# Altium schematic sheet XIAO_S3.SchDoc
size A4; SheetNumber: 2; SheetTotal: 7
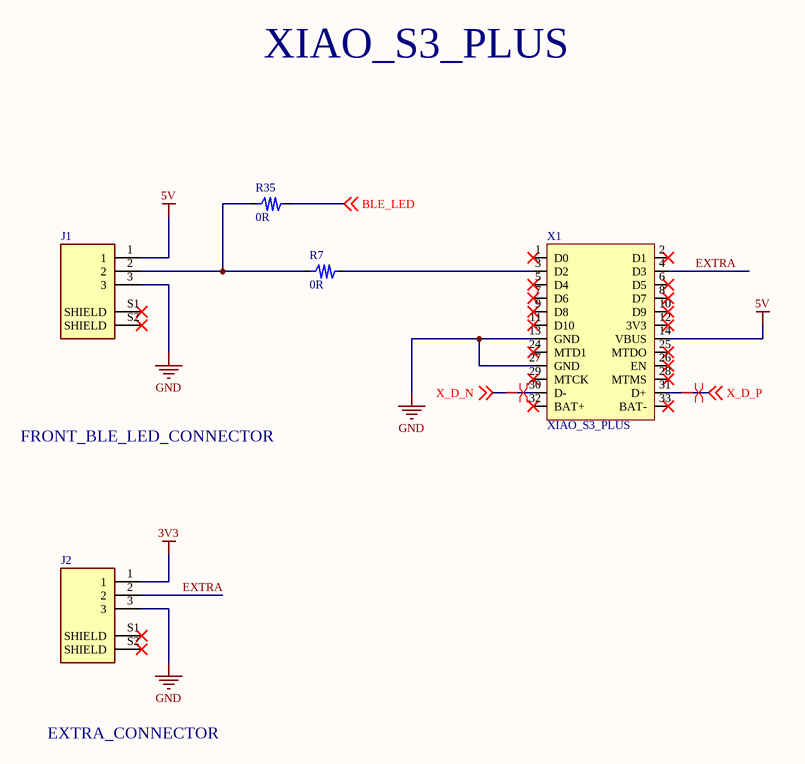
[diagram p0: XIAO_S3.SchDoc]

## Parts
J1  SM03B-SRSS-TB(LF)(SN)  [JST_SM03B-SRSS-TB(LF)(SN)]  (value not drawn)
J2  SM03B-SRSS-TB(LF)(SN)  [JST_SM03B-SRSS-TB(LF)(SN)]  (value not drawn)
R7  0R  [RES 0603]
R35  0R  [RES 0603]
X1  XIAO_S3_PLUS  [XIAO_S3_PLUS]

## Nets
3V3: J2.1
5V: J1.1 X1.14(VBUS)
GND: J1.3 J2.3 X1.13(GND) X1.27(GND)
BLE_LED: R35.2 ; off-sheet BLE_LED
EXTRA: J2.2 X1.4(D3)
X_D_N: X1.30(D-) ; off-sheet X_D_N
X_D_P: X1.31(D+) ; off-sheet X_D_P
NetJ1_2: J1.2 R7.1 R35.1
NetR7_2: R7.2 X1.3(D2)

Not connected (* = marked no-connect by the designer): J1 S1(SHIELD)* S2(SHIELD)*; J2 S1(SHIELD)* S2(SHIELD)*; X1 1(D0)* 2(D1)* 5(D4)* 6(D5)* 7(D6)* 8(D7)* 9(D8)* 10(D9)* 11(D10)* 12(3V3)* 24(MTD1)* 25(MTDO)* 26(EN)* 28(MTMS)* 29(MTCK)* 32(BAT+)* 33(BAT-)*

## Layout directives
differential pair: X_D_N, X_D_P

## Notes on the sheet
- XIAO_S3_PLUS
- FRONT_BLE_LED_CONNECTOR
- EXTRA_CONNECTOR

## Library data of the parts
J1 J2 = SM03B-SRSS-TB(LF)(SN): Connector Header Surface Mount, Right Angle 3 position 0.039 (1.00mm); Manufacture: JST; Part Number: SM03B-SRSS-TB(LF)(SN); Footprint size: SMD,P=1mm,Surface Mount,Right Angle; Supplier: LCSC; Supplier Part Number: C160403
  J1: Link: https://www.lcsc.com/product-detail/C160403.html?s_z=n_q_SM03B-SRSS-TB%2520%28LF%29%28SN%29&spm=wm.ssy.bg.0.xh&lcsc_vid=RFYMBlMFQAQLUVJeFVJZXwVeRFYIAgBXEVkPUlxRRVUxVlNRT1FYV1xXRVRYUjsOAxUeFF5JWBYZEEoKFBINSQcJGk4eFQsCAgIaSgADAwAHC0slRldeVFFSWQkaCgg%3D
  J2: Link: https://www.lcsc.com/product-detail/C160403.html?s_z=n_q_SM03B-SRSS-TB%2520%28LF%29%28SN%29&spm=wm.ssy.bg.0.xh&lcsc_vid=RFYMBlMFQAQLUVJeFVJZXwVeRFYIAgBXEVkPUlxRRVUxVlNRT1FbVVBSRFBeUjsOAxUeFF5JWBYZEEoKFBINSQcJGk4%3D
R7 R35 = Resistor: Manufacture: YAGEO; Part Number: RC0603JR-070RL; Footprint size: 0603; ComponentLink1Description: New link; ComponentLink1URL: *; Supplier: LCSC; Supplier Part Number: C95177; Link: https://www.lcsc.com/product-detail/C95177.html?spm=wm.fly.bg.0.xh___wm.sy.top.tjl.8-58&lcsc_vid=EwNbUgICTlRcBlxXEQRYAgYAFVkLVwZURVRZBVcDFVcxVlNRQVhdXlVXT1hfVjsOAxUeFF5JWBYZEEoBGA4JCwFIFA4DSA%3D%3D